# EAGLE design Yukari 4 Copernicus 11DoF (EAGLE 6.2)
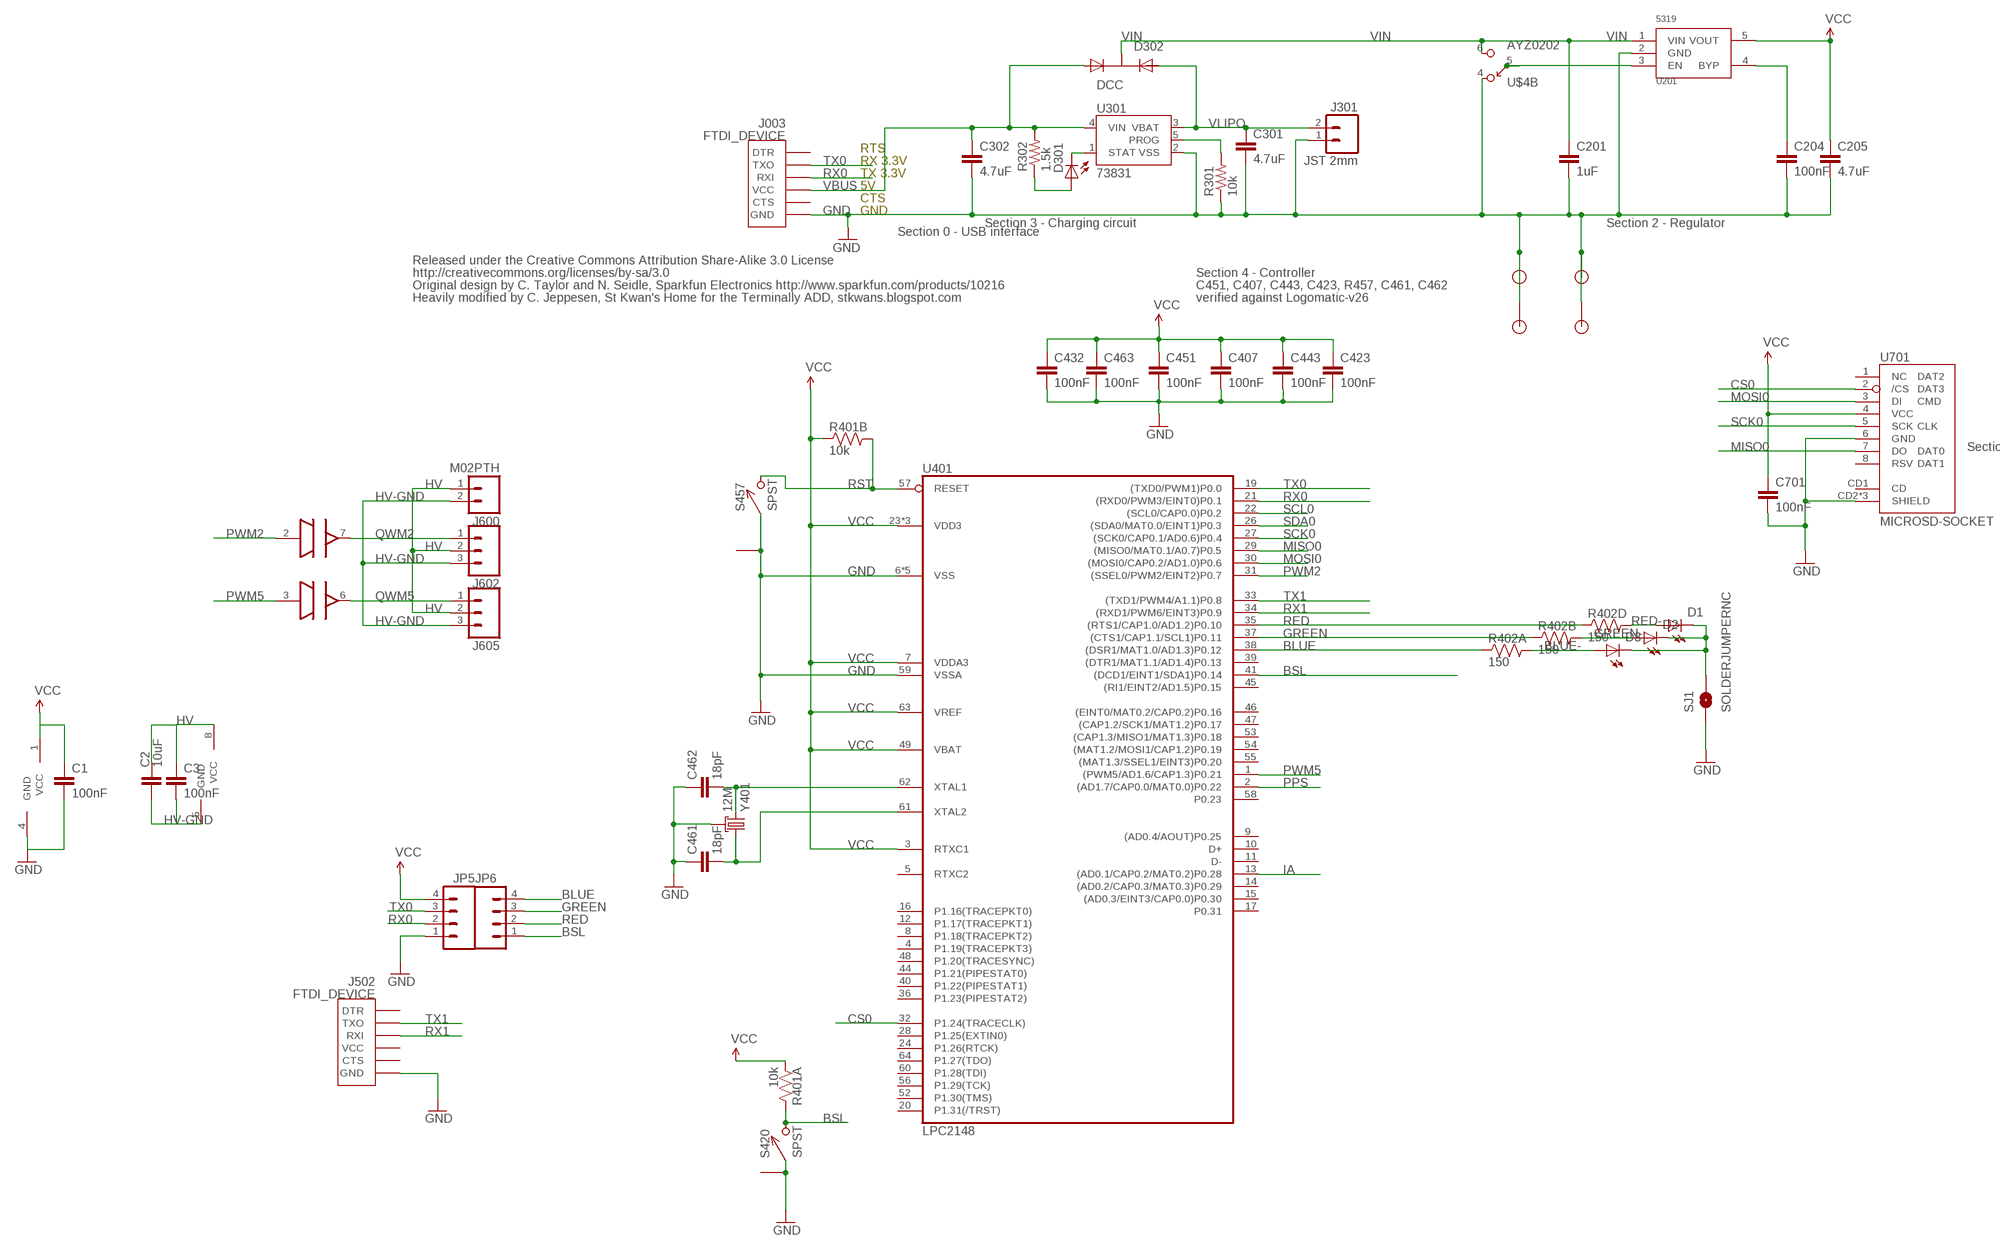
[diagram p0: schematic, sheet 1, part 1 of 2]
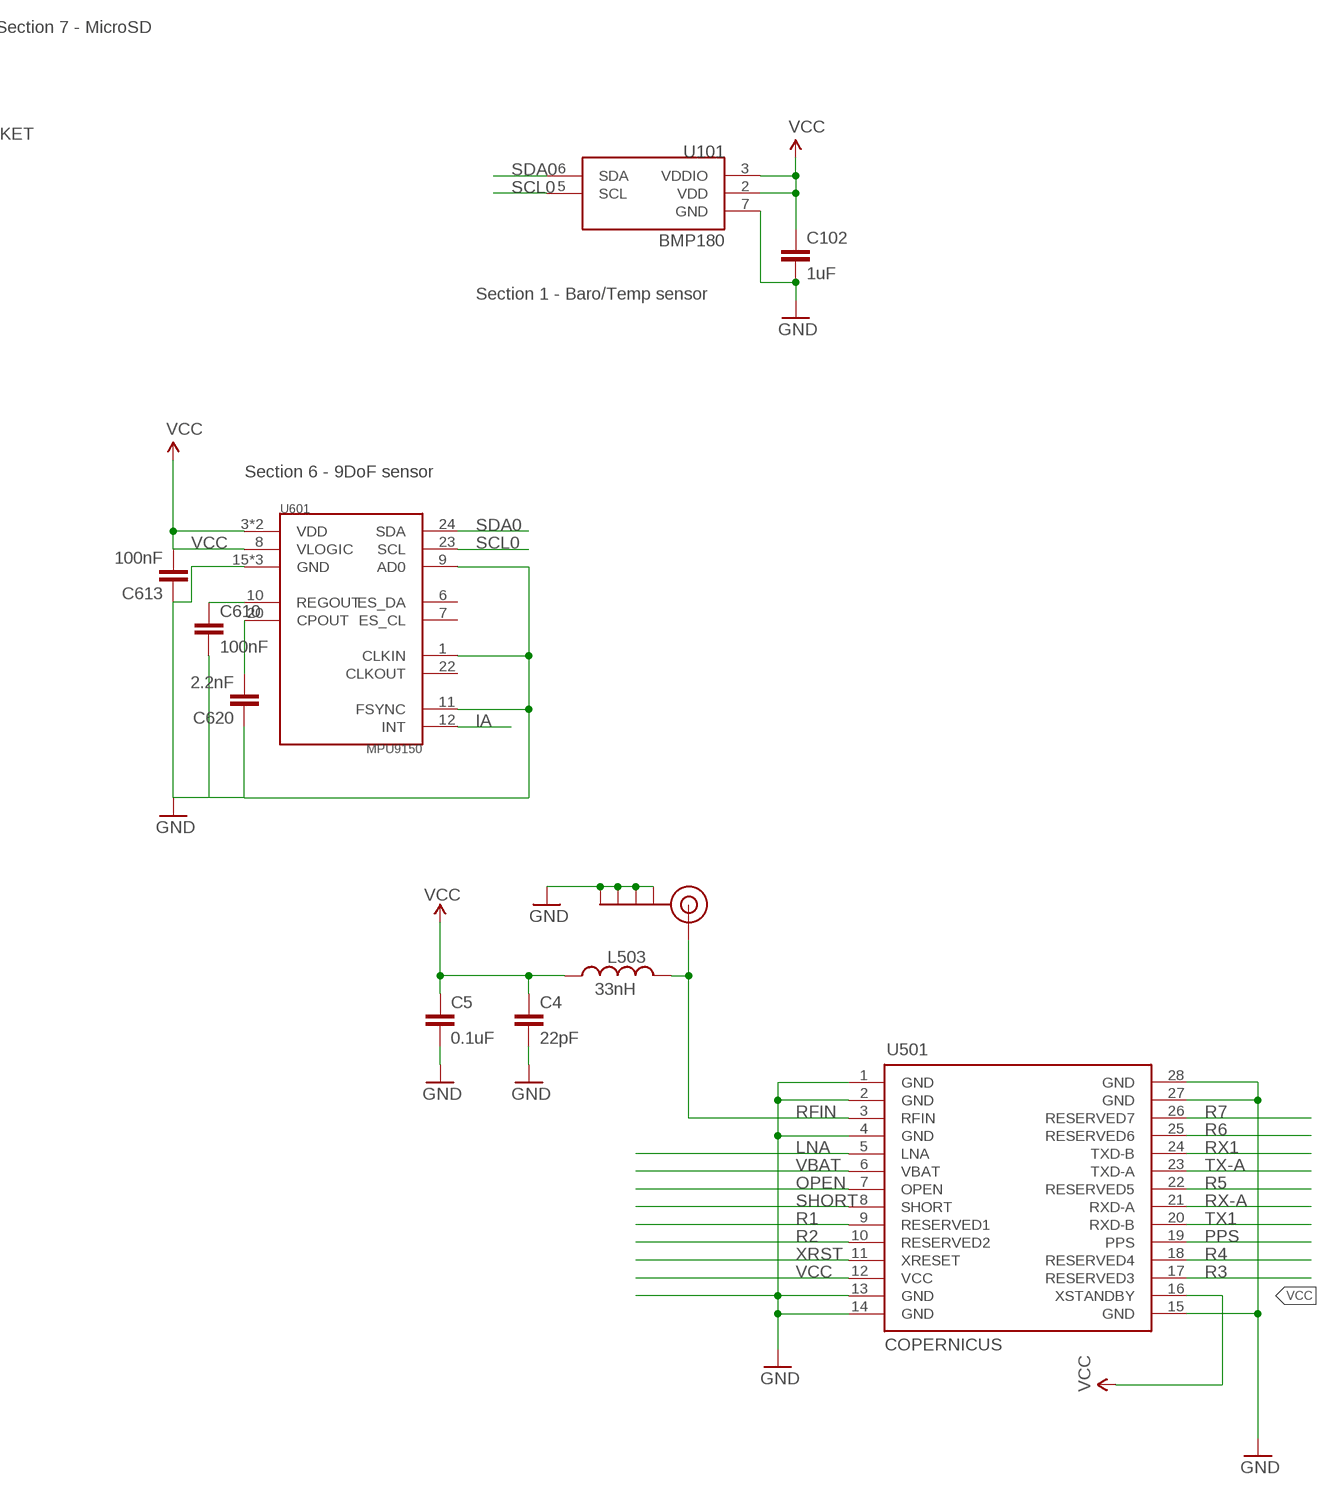
[diagram p1: schematic, sheet 1, part 2 of 2]

## Parts
C1  100nF  CAP0402-CAP  [0402-CAP]
C2  10uF  CAP0603-CAP  [0603-CAP]
C3  100nF  CAP0402-CAP  [0402-CAP]
C4  22pF  CAP0603-CAP  [0603-CAP]
C5  0.1uF  CAP0603-CAP  [0603-CAP]
C102  1uF  CAP0402-CAP  [0402-CAP]
C201  1uF  CAP0402-CAP  [0402-CAP]
C204  100nF  CAP0402-CAP  [0402-CAP]
C205  4.7uF  CAP0402-CAP  [0402-CAP]
C301  4.7uF  CAP0402-CAP  [0402-CAP]
C302  4.7uF  CAP0402-CAP  [0402-CAP]
C407  100nF  CAP0402-CAP  [0402-CAP]
C423  100nF  CAP0402-CAP  [0402-CAP]
C432  100nF  CAP0402-CAP  [0402-CAP]
C443  100nF  CAP0402-CAP  [0402-CAP]
C451  100nF  CAP0402-CAP  [0402-CAP]
C461  18pF  CAP0402-CAP  [0402-CAP]
C462  18pF  CAP0402-CAP  [0402-CAP]
C463  100nF  CAP0402-CAP  [0402-CAP]
C610  100nF  CAP0402-CAP  [0402-CAP]
C613  100nF  CAP0402-CAP  [0402-CAP]
C620  2.2nF  CAP0402-CAP  [0402-CAP]
C701  100nF  CAP0402-CAP  [0402-CAP]
D1  RED  LED0603  [LED-0603]
D2  GREEN  LED0603  [LED-0603]
D3  BLUE  LED0603  [LED-0603]
D301  RED  LED0603  [LED-0603]
D302  DCC  PMEG2005CT  [SOT-23-3]
J003  FTDI_DEVICE  [FTDI_DEVICE_SIDE]
J301  JST 2mm  M02-JST-2MM-SMT  [JST-2-SMD]
J502  FTDI_DEVICE  [FTDI_DEVICE_SIDE]
J600  M02PTH  [1X02]
J602  M03PTH  [1X03]
J605  M03PTH  [1X03]
JP1  STANDOFF  [STANDOFF]
JP2  STANDOFF  [STANDOFF]
JP3  STANDOFF  [STANDOFF]
JP4  STANDOFF  [STANDOFF]
JP5  M04PTH  [1X04]
JP6  M04PTH  [1X04]
JP7  SMA_EDGE  [SMA_EDGE]
L503  33nH  INDUCTOR0603  [0603]
R301  10k  RESISTOR0402-RES  [0402-RES]
R302  1.5k  RESISTOR0402-RES  [0402-RES]
R401  10k  RP2EXB24V  [CRA02]
R402  150  RP404  [CRA04]
S420  SPST  B3U-1100P  [B3U-1100P]
S457  SPST  B3U-1100P  [B3U-1100P]
SJ1  SOLDERJUMPERNC  [SJ_2S]
U101  BMP180  [BMP180]
U201  5319  MIC5319D5  [SOT-23-5]
U301  73831  MCP73831  [SOT23-5]
U401  LPC2148  [LQFP64]
U501  COPERNICUS  COPERNICUSSMD  [COPERNICUS]
U600  ADUM3221  [SO8N]
U601  MPU9150  [LLGA24]
U701  MICROSD-SOCKET  [MICROSD-SOCKET-PP]
U$4  AYZ0202  [AYZ0202]
Y401  12M  TSX-3225  [CRYSTAL_SMD]

## Nets
BLUE: JP6.4 R402.1 U401.38((DSR1/MAT1.0/AD1.3)P0.12)
BLUE-: D3.A R402.8
BSL: JP6.1 R401.4 S420.P$2 U401.41((DCD1/EINT1/SDA1)P0.14)
CHG_PROG: R301.2 U301.5(PROG)
CS0: U401.32(P1.24(TRACECLK)) U701.2(/CS)
EN: U201.3(EN) U$4.5
GND: C1.2 C4.2 C5.2 C102.2 C201.2 C204.2 C205.2 C301.2 C302.2 C407.2 C423.2 C432.2 C443.2 C451.2 C461.1 C462.1 C463.2 C610.2 C613.1 C620.1 C701.2 J003.P$6(GND) J301.1 J502.P$6(GND) JP1.P$1 JP2.P$1 JP3.P$1 JP4.P$1 JP5.1 JP7.GND@0(GND) JP7.GND@1(GND) JP7.GND@2(GND) JP7.GND@3(GND) R301.1 S420.P$1 S420.P$3 S457.P$1 S457.P$3 SJ1.1 U101.7(GND) U201.2(GND) U301.2(VSS) U401.6(VSS) U401.18(VSS) U401.25(VSS) U401.42(VSS) U401.50(VSS) U401.59(VSSA) U501.1(GND) U501.2(GND) U501.4(GND) U501.13(GND) U501.14(GND) U501.15(GND) U501.27(GND) U501.28(GND) U600.4(INP:GND) U601.1(CLKIN) U601.9(AD0) U601.11(FSYNC) U601.15(GND) U601.17(GND) U601.18(GND) U701.6(GND) U701.CD2(SHIELD) U701.GND1(SHIELD) U701.GND3(SHIELD) U$4.4 Y401.2(GND) Y401.4(GND)
GREEN: JP6.3 R402.2 U401.37((CTS1/CAP1.1/SCL1)P0.11)
GREEN-: D2.A R402.7
HV: C2.1 C3.1 J600.1 J602.2 J605.2 U600.8(OUTP:VCC)
HV-GND: C2.2 C3.2 J600.2 J602.3 J605.3 U600.5(OUTP:GND)
IA: U401.13((AD0.1/CAP0.2/MAT0.2)P0.28) U601.12(INT)
LNA: U501.5(LNA)
MISO0: U401.29((MISO0/MAT0.1/A0.7)P0.5) U701.7(DO)
MOSI0: U401.30((MOSI0/CAP0.2/AD1.0)P0.6) U701.3(DI)
N$1: D1.C D2.C D3.C SJ1.2
N$2: C610.1 U601.10(REGOUT)
N$3: C620.2 U601.20(CPOUT)
N$17: C204.1 U201.4(BYP)
OPEN: U501.7(OPEN)
PPS: U401.2((AD1.7/CAP0.0/MAT0.0)P0.22) U501.19(PPS)
PWM2: U401.31((SSEL0/PWM2/EINT2)P0.7) U600.2(A:IN)
PWM5: U401.1((PWM5/AD1.6/CAP1.3)P0.21) U600.3(B:IN)
QWM2: J602.1 U600.7(A:OUT)
QWM5: J605.1 U600.6(B:OUT)
R1: U501.9(RESERVED1)
R2: U501.10(RESERVED2)
R3: U501.17(RESERVED3)
R4: U501.18(RESERVED4)
R5: U501.22(RESERVED5)
R6: U501.25(RESERVED6)
R7: U501.26(RESERVED7)
RED: JP6.2 R402.4 U401.35((RTS1/CAP1.0/AD1.2)P0.10)
RED-: D1.A R402.5
RFIN: JP7.SIG(SIGNAL) L503.2 U501.3(RFIN)
RST: R401.3 S457.P$2 U401.57(RESET)
RX0: J003.P$3(RXI) JP5.2 U401.21((RXD0/PWM3/EINT0)P0.1)
RX1: J502.P$3(RXI) U401.34((RXD1/PWM6/EINT3)P0.9) U501.24(TXD-B)
RX-A: U501.21(RXD-A)
SCK0: U401.27((SCK0/CAP0.1/AD0.6)P0.4) U701.5(SCK)
SCL0: U101.5(SCL) U401.22((SCL0/CAP0.0)P0.2) U601.23(SCL)
SDA0: U101.6(SDA) U401.26((SDA0/MAT0.0/EINT1)P0.3) U601.24(SDA)
SHORT: U501.8(SHORT)
STAT+: D301.A R302.1
STAT-: D301.C U301.1(STAT)
TX0: J003.P$2(TXO) JP5.3 U401.19((TXD0/PWM1)P0.0)
TX1: J502.P$2(TXO) U401.33((TXD1/PWM4/A1.1)P0.8) U501.20(RXD-B)
TX-A: U501.23(TXD-A)
VBAT: U501.6(VBAT)
VBUS [power]: C302.1 D302.1(A1) J003.P$4(VCC) R302.2 U301.4(VIN)
VCC: C1.1 C4.1 C5.1 C102.1 C205.1 C407.1 C423.1 C432.1 C443.1 C451.1 C463.1 C613.2 C701.1 JP5.4 L503.1 R401.1 R401.2 U101.2(VDD) U101.3(VDDIO) U201.5(VOUT) U401.3(RTXC1) U401.7(VDDA3) U401.23(VDD3) U401.43(VDD3) U401.49(VBAT) U401.51(VDD3) U401.63(VREF) U501.12(VCC) U501.16(XSTANDBY) U600.1(INP:VCC) U601.3(VDD) U601.8(VLOGIC) U601.13(VDD) U701.4(VCC)
VIN: C201.1 D302.3(K) U201.1(VIN) U$4.6
VLIPO [power]: C301.1 D302.2(A2) J301.2 U301.3(VBAT)
XRST: U501.11(XRESET)
XTAL1: C462.2 U401.62(XTAL1) Y401.3
XTAL2: C461.2 U401.61(XTAL2) Y401.1
Unconnected: J003.P$1(DTR) J003.P$5(CTS) J502.P$1(DTR) J502.P$4(VCC) J502.P$5(CTS) R402.3 R402.6 U401.4(P1.19(TRACEPKT3)) U401.5(RTXC2) U401.8(P1.18(TRACEPKT2)) U401.9((AD0.4/AOUT)P0.25) U401.10(D+) U401.11(D-) U401.12(P1.17(TRACEPKT1)) U401.14((AD0.2/CAP0.3/MAT0.3)P0.29) U401.15((AD0.3/EINT3/CAP0.0)P0.30) U401.16(P1.16(TRACEPKT0)) U401.17(P0.31) U401.20(P1.31(/TRST)) U401.24(P1.26(RTCK)) U401.28(P1.25(EXTIN0)) U401.36(P1.23(PIPESTAT2)) U401.39((DTR1/MAT1.1/AD1.4)P0.13) U401.40(P1.22(PIPESTAT1)) U401.44(P1.21(PIPESTAT0)) U401.45((RI1/EINT2/AD1.5)P0.15) U401.46((EINT0/MAT0.2/CAP0.2)P0.16) U401.47((CAP1.2/SCK1/MAT1.2)P0.17) U401.48(P1.20(TRACESYNC)) U401.52(P1.30(TMS)) U401.53((CAP1.3/MISO1/MAT1.3)P0.18) U401.54((MAT1.2/MOSI1/CAP1.2)P0.19) U401.55((MAT1.3/SSEL1/EINT3)P0.20) U401.56(P1.29(TCK)) U401.58(P0.23) U401.60(P1.28(TDI)) U401.64(P1.27(TDO)) U601.6(ES_DA) U601.7(ES_CL) U601.22(CLKOUT) U701.1(NC) U701.8(RSV) U701.CD1(CD) U$4.1 U$4.2 U$4.3

## Notes on the sheet
- RTS
- RX 3.3V
- TX 3.3V
- 5V
- CTS
- GND
- Section 0 - USB interface | Section 3 - Charging circuit | Section 2 - Regulator
- Released under the Creative Commons Attribution Share-Alike 3.0 License
- http://creativecommons.org/licenses/by-sa/3.0 | Section 4 - Controller
- Original design by C. Taylor and N. Seidle, Sparkfun Electronics http://www.sparkfun.com/products/10216 | C451, C407, C443, C423, R457, C461, C462
- Heavily modified by C. Jeppesen, St Kwan's Home for the Terminally ADD, stkwans.blogspot.com | verified against Logomatic-v26
- Section 7 - MicroSD
- Section 1 - Baro/Temp sensor
- Section 6 - 9DoF sensor

## Library data of the parts
C1 C3 C201 C204 C205 C301 C302 C407 C423 C432 C443 C451 C461-C463 C701 = SparkFun:CAP: Capacitor Standard 0603 ceramic capacitor, and 0.1" leaded capacitor.
C2 = SparkFun:CAP: Capacitor Standard 0603 ceramic capacitor, and 0.1" leaded capacitor.; DIGIKEY: 445-7486-1-ND
C4 C5 = SparkFun-Passives:CAP: Capacitor Standard 0603 ceramic capacitor, and 0.1" leaded capacitor.
C102 C610 C613 = SparkFun-Passives:CAP: Capacitor Standard 0603 ceramic capacitor, and 0.1" leaded capacitor.; DIGIKEY: 445-1317-2-ND
C620 = SparkFun-Passives:CAP: Capacitor Standard 0603 ceramic capacitor, and 0.1" leaded capacitor.; DIGIKEY: 445-1309-2-ND
D1-D3 D301 = SparkFun:LED: LEDs Standard schematic elements and footprints for 5mm, 3mm, 1206, and 0603 sized LEDs. 5mm - Spark Fun Electronics SKU : COM-00529 (and others)
D302 = KwanSystems:PMEG2005CT
J003 J502 = SparkFun-Connectors:FTDI_DEVICE: Connector which mates to FTDI basic or FTDI cable.
J301 = SparkFun:M02: Header 2 Standard 2-pin 0.1" header. Use with straight break away headers (SKU : PRT-00116), right angle break away headers (PRT-00553), swiss pins (PRT-00743), machine pins (PRT-00117), and female headers (PRT-00115). Molex polarized connector foot print use with SKU : PRT-08233 with associated crimp pins and housings.
J600 = SparkFun-Connectors:M02: Standard 2-pin 0.1" header. Use with - straight break away headers ( PRT-00116) - right angle break away headers (PRT-00553) - swiss pins (PRT-00743) - machine pins (PRT-00117) - female headers (PRT-00115) Molex polarized connector foot print use with: PRT-08233 with associated crimp pins and housings. 2.54_SCREWTERM for use with PRT-10571. 3.5mm Screw Terminal footprints for PRT-08084 5mm Screw Terminal footprints for use with PRT-08433
J602 J605 = SparkFun-Connectors:M03: Header 3 Standard 3-pin 0.1" header. Use with straight break away headers (SKU : PRT-00116), right angle break away headers (PRT-00553), swiss pins (PRT-00743), machine pins (PRT-00117), and female headers (PRT-00115). Molex polarized connector foot print use with SKU : PRT-08232 with associated crimp pins and housings.
JP1-JP4 = KwanSystems:STANDOFF
JP5 JP6 = SparkFun-Connectors:M04: Header 4 Standard 4-pin 0.1" header. Use with straight break away headers (SKU : PRT-00116), right angle break away headers (PRT-00553), swiss pins (PRT-00743), machine pins (PRT-00117), and female headers (PRT-00115). Molex polarized connector foot print use with SKU : PRT-08231 with associated crimp pins and housings. 1MM SMD Version SKU: PRT-10208
JP7 = SparkFun-Nate:SMA_EDGE
L503 = SparkFun-Passives:INDUCTOR: Inductors Basic Inductor/Choke - 0603 and 1206. Footprints are not proven and vary greatly between part numbers.
R301 R302 = SparkFun:RESISTOR: Resistor Basic schematic elements and footprints for 0603, 1206, and PTH resistors.
R401 = KwanSystems:RP2
R402 = KwanSystems:RP4
S420 S457 = KwanSystems:B3U-1100P
SJ1 = SparkFun-Passives:SOLDERJUMPER: Solder Jumper Standard SMD solder jumper. Used to automate production. Two varients : Normally Open and Normally Closed are the same, but have different paste layers. NC will have a large amount of paste and should jumper during reflow.
U101 = KwanSystems:BMP180; DIGIKEY: 828-1027-1-ND
U201 = KwanSystems:MIC5319
U301 = SparkFun:MCP73831: Microchip's MCP73831 Miniature single cell, fully integrated Li-Ion, Li-polymer charge management controller http://ww1.microchip.com/downloads/en/DeviceDoc/21984a.pdf
U401 = KwanSystems:LPC2148
U501 = SparkFun-RF:COPERNICUS: Copernicus II GPS- Trimble recommended layout and paste layer. Footprint production proven. Spark Fun Electronics SKU : GPS-07951
U600 = KwanSystems:ADUM3221
U601 = KwanSystems:MPU9150
U701 = KwanSystems:MICROSD-SOCKET: microSD Socket Push-push type uSD socket. Digikey 101-00660-68-6-1-ND. tDoc lines correctly indicate media card edge positions when inserting (unlocked, locked, depressed).
U$4 = KwanSystems:AYZ0202
Y401 = KwanSystems:TSX-3225

## Net classes
0 default: width 0.152 mm, drill 0.33 mm, clearance 0.152 mm
1 power: width 0.152 mm, drill 0.33 mm, clearance 0.152 mm
2 hp: width 0.508 mm, drill 0.33 mm, clearance 0.508 mm

## Board
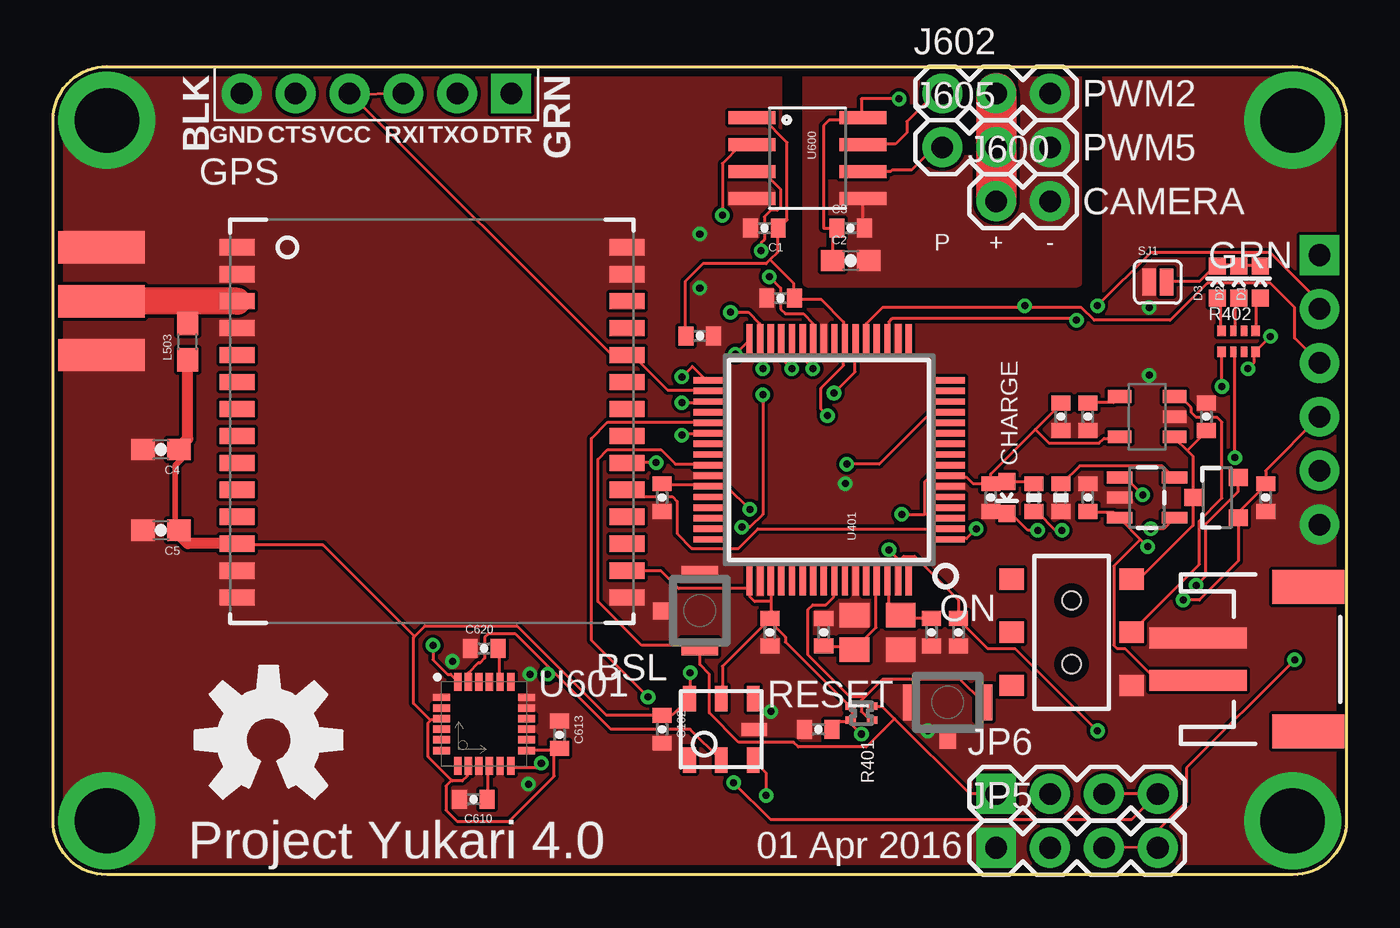
[diagram p2: board, top side]
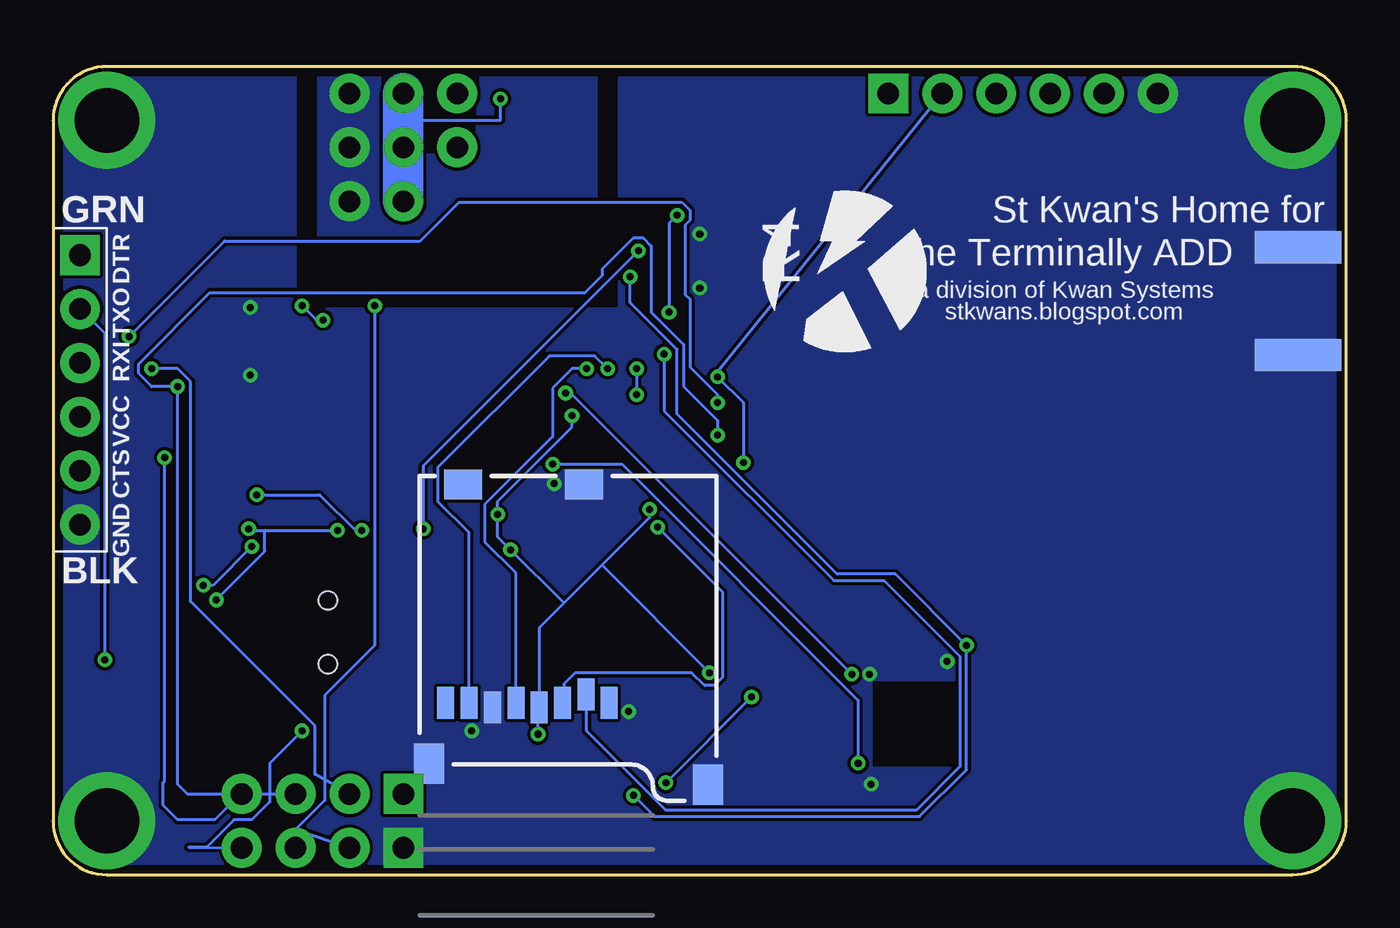
[diagram p3: board, bottom side, seen from below]

Size 60.96 x 38.1 mm. Coordinates in mm from the lower left corner, seen from the top.
Outline: 2.54,38.1 58.42,38.1 arc-90 60.96,35.56 60.96,2.54 arc-90 58.42,0 2.54,0 arc-90 0,2.54 0,35.56 arc-90 2.54,38.1
Copper layers (1*16): Top 0.0356mm / dielectric 1.5011mm / Bottom 0.0356mm
Design rules: minimum track width 6mil, minimum drill 13mil, track to track 6mil, track to pad 6mil, pad to pad 6mil, via to via 6mil, smd to smd 6mil, copper to edge 15mil, drill to drill 6mil, minimum pad ring 7mil, minimum via ring 7mil, stop-mask expansion 4mil, vias tented up to drill 14mil, thermal gap 10mil
vRestrict: area 0.3,28.7 to 19.6,31.5; area 1.5,27.2 to 19.6,27.9; area 41.9,11.9 to 43.9,13.2; area 20.1,25.1 to 27.2,32.3

### Footprints (pad centres in the part's own frame; a part is rotated, then mirrored left to right if it is on the bottom)
0402-CAP = smd 0.7 x 0.9: 1 -0.65,0; 2 0.65,0
0603-CAP = smd 1.1 x 1: 1 -0.85,0; 2 0.85,0
LED-0603 = smd 0.8 x 0.8: A 0,-0.75; C 0,0.75
SOT-23-3 = smd 0.9 x 0.8: 1 -1,0.95; 2 -1,-0.95; 3 1.1,0
FTDI_DEVICE_SIDE = drill 1.016 pad 1.88 square: P$1 -6.35,0 | drill 1.016 pad 1.88: P$2 -3.81,0; P$3 -1.27,0; P$4 1.27,0; P$5 3.81,0; P$6 6.35,0
JST-2-SMD = smd 1 x 4.6: 1 -1,-3.7; 2 1,-3.7 | smd 1.6 x 3.4: NC1 -3.4,1.5; NC2 3.4,1.5
1X02 = drill 1.016 pad 1.88: 1 0,0; 2 2.54,0
1X03 = drill 1.016 pad 1.88: 1 0,0; 2 2.54,0; 3 5.08,0
STANDOFF = drill 3.048 pad 4.572: P$1 0,0
1X04 = drill 1.016 pad 1.88 square: 1 0,0 | drill 1.016 pad 1.88: 2 2.54,0; 3 5.08,0; 4 7.62,0
SMA_EDGE = smd 1.524 x 4.064: GND@0 0,0; GND@1 5.08,0; SIG 2.54,0 | smd 1.524 x 4.064 bottom: GND@2 0,0; GND@3 5.08,0
0603 = smd 1.1 x 1: 1 -0.85,0; 2 0.85,0
0402-RES = smd 0.7 x 0.9: 1 -0.65,0; 2 0.65,0
CRA02 = smd 0.35 x 0.5: 1 -0.325,-0.5; 2 0.325,-0.5; 3 0.325,0.5; 4 -0.325,0.5
CRA04 = smd 0.4 x 0.5: 1 -0.8,-0.5; 4 0.8,-0.5; 5 0.8,0.5; 8 -0.8,0.5 | smd 0.3 x 0.5: 2 -0.25,-0.5; 3 0.25,-0.5; 6 0.25,0.5; 7 -0.25,0.5
B3U-1100P = smd 0.8 x 1.7: P$1 -1.7,0; P$2 1.7,0 | smd 0.8 x 1.1: P$3 0,-1.65
SJ_2S = smd 0.635 x 1.27: 1 -0.412,0; 2 0.412,0
BMP180 = smd 0.6 x 1.2: 1 1.5,1.45; 2 0,1.45; 3 -1.5,1.45; 4 -1.5,-1.45; 5 0,-1.45; 6 1.5,-1.45 | smd 1.2 x 0.6: 7 1.55,0
SOT-23-5 = smd 0.6 x 1.1: 1 -0.95,-1.3; 2 0,-1.3; 3 0.95,-1.3; 4 0.95,1.3; 5 -0.95,1.3
SOT23-5 = smd 0.55 x 1.2: 1 -0.95,-1.3; 2 0,-1.3; 3 0.95,-1.3; 4 0.95,1.3; 5 -0.95,1.3
LQFP64 = smd 0.3 x 1.6: 1 -3.75,-5.6; 2 -3.25,-5.6; 3 -2.75,-5.6; 4 -2.25,-5.6; 5 -1.75,-5.6; 6 -1.25,-5.6; 7 -0.75,-5.6; 8 -0.25,-5.6; 9 0.25,-5.6; 10 0.75,-5.6; 11 1.25,-5.6; 12 1.75,-5.6; 13 2.25,-5.6; 14 2.75,-5.6; 15 3.25,-5.6; 16 3.75,-5.6; 33 3.75,5.6; 34 3.25,5.6; 35 2.75,5.6; 36 2.25,5.6; 37 1.75,5.6; 38 1.25,5.6; 39 0.75,5.6; 40 0.25,5.6; 41 -0.25,5.6; 42 -0.75,5.6; 43 -1.25,5.6; 44 -1.75,5.6; 45 -2.25,5.6; 46 -2.75,5.6; 47 -3.25,5.6; 48 -3.75,5.6 | smd 1.6 x 0.3: 17 5.6,-3.75; 18 5.6,-3.25; 19 5.6,-2.75; 20 5.6,-2.25; 21 5.6,-1.75; 22 5.6,-1.25; 23 5.6,-0.75; 24 5.6,-0.25; 25 5.6,0.25; 26 5.6,0.75; 27 5.6,1.25; 28 5.6,1.75; 29 5.6,2.25; 30 5.6,2.75; 31 5.6,3.25; 32 5.6,3.75; 49 -5.6,3.75; 50 -5.6,3.25; 51 -5.6,2.75; 52 -5.6,2.25; 53 -5.6,1.75; 54 -5.6,1.25; 55 -5.6,0.75; 56 -5.6,0.25; 57 -5.6,-0.25; 58 -5.6,-0.75; 59 -5.6,-1.25; 60 -5.6,-1.75; 61 -5.6,-2.25; 62 -5.6,-2.75; 63 -5.6,-3.25; 64 -5.6,-3.75
COPERNICUS = smd 0.762 x 1.651: 1 0,-18.364; 2 1.27,-18.364; 3 2.54,-18.364; 4 3.81,-18.364; 5 5.08,-18.364; 6 6.35,-18.364; 7 7.62,-18.364; 8 8.89,-18.364; 9 10.16,-18.364; 10 11.43,-18.364; 11 12.7,-18.364; 12 13.97,-18.364; 13 15.24,-18.364; 14 16.51,-18.364; 15 16.51,0; 16 15.24,0; 17 13.97,0; 18 12.7,0; 19 11.43,0; 20 10.16,0; 21 8.89,0; 22 7.62,0; 23 6.35,0; 24 5.08,0; 25 3.81,0; 26 2.54,0; 27 1.27,0; 28 0,0
SO8N = smd 0.61 x 2.21: 1 -1.905,-2.616; 2 -0.635,-2.616; 3 0.635,-2.616; 4 1.905,-2.616; 5 1.905,2.616; 6 0.635,2.616; 7 -0.635,2.616; 8 -1.905,2.616
LLGA24 = smd 0.8 x 0.35: 1 -2,1.25; 2 -2,0.75; 3 -2,0.25; 4 -2,-0.25; 5 -2,-0.75; 6 -2,-1.25; 13 2,-1.25; 14 2,-0.75; 15 2,-0.25; 16 2,0.25; 17 2,0.75; 18 2,1.25 | smd 0.35 x 0.85: 7 -1.25,-1.975; 8 -0.75,-1.975; 9 -0.25,-1.975; 10 0.25,-1.975; 11 0.75,-1.975; 12 1.25,-1.975; 19 1.25,1.975; 20 0.75,1.975; 21 0.25,1.975; 22 -0.25,1.975; 23 -0.75,1.975; 24 -1.25,1.975
MICROSD-SOCKET-PP = smd 0.8 x 1.5: 1 -8.94,10.7; 2 -7.84,10.3; 3 -6.74,10.7; 4 -5.64,10.9; 5 -4.54,10.7; 6 -3.44,10.9; 7 -2.34,10.7; 8 -1.24,10.7 | smd 1.8 x 1.4: CD1 -2.05,0.4; CD2 -7.75,0.4 | smd 1.4 x 1.9: GND1 -13.6,14.55; GND3 -0.45,13.55
AYZ0202 = smd 1 x 1.15: 1 -2.5,2.825; 2 0,2.825; 3 2.5,2.825; 4 -2.5,-2.825; 5 0,-2.825; 6 2.5,-2.825 | hole 0.85: 1.5,0; -1.5,0
CRYSTAL_SMD = smd 1.4 x 1.15: 1 -1.092,-0.813; 2 1.092,-0.813; 3 1.092,0.813; 4 -1.092,0.813

### Placement (x,y rotation side)
C1  33.53,30.48 180 top
C2  37.59,28.96 0 top
C3  37.59,30.48 0 top
C4  5.08,20.05 180 top
C5  5.08,16.24 180 top
C102  28.7,6.86 270 top
C201  54.36,21.59 90 top
C204  48.77,21.59 270 top
C205  47.5,21.59 270 top
C301  48.77,17.78 90 top
C302  57.15,17.78 270 top
C407  44.2,17.78 270 top
C423  34.29,27.18 180 top
C432  30.48,25.4 0 top
C443  28.7,17.78 270 top
C451  33.78,11.43 270 top
C461  36.32,11.43 270 top
C462  41.4,11.43 90 top
C463  42.67,11.43 270 top
C610  19.81,3.56 180 top
C613  23.88,6.6 270 top
C620  20.32,10.67 0 top
C701  36.07,6.86 180 top
D1  56.9,27.94 0 top
D2  55.88,27.94 0 top
D3  54.86,27.94 0 top
D301  44.96,17.78 180 top
D302  54.86,17.78 180 top
J003  59.69,22.86 270 bottom
J301  57.66,10.16 270 top
J502  15.24,36.83 180 top
J600  44.45,31.75 0 top
J602  41.91,36.83 0 top
J605  41.91,34.29 0 top
JP1  2.54,2.54 0 top
JP2  58.42,2.54 0 top
JP3  2.54,35.56 0 top
JP4  58.42,35.56 0 top
JP5  44.45,1.27 0 top
JP6  44.45,3.81 0 top
JP7  2.29,24.5 90 top
L503  6.35,25.13 90 top
R301  47.5,17.78 90 top
R302  46.23,17.78 270 top
R401  38.1,7.62 270 top
R402  55.88,25.15 0 top
S420  30.48,12.45 270 top
S457  42.16,8.13 0 top
SJ1  52.07,27.94 0 top
U101  31.5,6.86 0 top
U201  51.56,21.59 90 top
U301  51.56,17.78 270 top
U401  36.58,19.56 90 top
U501  27.05,29.57 270 top
U600  35.56,33.78 270 top
U601  20.32,7.11 0 top
U701  43.69,18.8 180 bottom
U$1  [KWAN_CIRCLE]  23.62,28.45 0 bottom
U$2  [OSHW-LOGO-L]  10.16,6.35 0 top
U$4  48.01,11.43 90 top
Y401  38.86,11.43 0 top

### Tracks (layer width: path | path; a pad name or v marks a point on that pad's centre or on a via)
BLUE  (via drill 0.33)
  Top 0.152: v55.09,23.01 55.09,24.61 R402.1 | v29.64,20.73 29.72,20.8 30.94,20.8 U401.38
  Bottom 0.152: JP6.4 54.63,3.81 55.09,4.27 v55.09,23.01 56.31,23.01 56.92,23.62 56.92,24.08 53.57,27.43 35.89,27.43 35.05,28.27 35.05,28.57 33.6,30.02 33.15,30.02 32.77,29.64 32.77,26.52 31.24,24.99 31.24,23.01 29.64,21.41 v29.64,20.73
BLUE-
  Top 0.152: R402.8 55.02,25.68 55.02,26.98 54.86,27.13 D3.A
BSL
  Top 0.152: U401.41 30.94,19.36 29.34,19.36 28.65,20.04 26.14,20.04 25.68,19.58 25.68,12.88 27.74,10.82 30.48,10.82 S420.P$2 30.48,9.91 30.94,9.45 30.94,7.62 32.31,6.25 34.9,6.25 35.13,6.02 38.33,6.02 39.66,7.35 | 39.66,7.35 43.2,3.81 JP6.1 | 39.66,7.35 39.09,7.92 38.63,7.92 R401.4
CHG_PROG
  Top 0.152: R301.2 47.55,18.44 48.39,19.28 52.27,19.28 52.81,18.75 U301.5
CS0  (via drill 0.33)
  Top 0.152: v32.16,24.54 32.77,25.15 U401.32
  Bottom 0.152: v32.16,24.54 32.16,21.87 24.16,13.87 21.79,13.87 18.21,10.29 18.21,5.11 20.27,3.05 32.08,3.05 35.81,6.78 35.81,8.46 U701.2
EN
  Top 0.152: U201.3 52.88,22.48 53.19,22.48 53.65,22.02 53.65,21.79 53.87,21.57 54.86,21.57 55.09,21.34 55.09,17.75 54.03,16.69 54.03,14.63 U$4.5
GND  (via drill 0.33)
  other vias: 30.48,30.2 30.48,27.66 22.4,4.27 18.82,10.06 33.83,7.7 22.48,9.45 41.22,6.78 51.66,26.75 51.66,23.55 37.34,18.44
  pour Top (no thermals): 2.54,38.1 34.29,38.1 34.29,26.67 49.53,26.67 49.53,38.1 58.42,38.1 arc-90 60.96,35.56 60.96,2.54 arc-90 58.42,0 2.54,0 arc-90 0,2.54 0,35.56 arc-90
  pour Bottom (no thermals): 2.54,38.1 34.29,38.1 34.29,26.67 49.53,26.67 49.53,38.1 58.42,38.1 arc-90 60.96,35.56 60.96,2.54 arc-90 58.42,0 2.54,0 arc-90 0,2.54 0,35.56 arc-90
GREEN  (via drill 0.33)
  Top 0.152: v55.7,19.66 55.7,24.61 R402.2 | v28.04,8.38 25.38,11.05 25.38,20.57 26.14,21.34 30.94,21.34 U401.37 | v32.08,4.34 33.83,2.59 50.83,2.59 52.05,3.81 JP6.3
  Bottom 0.152: v55.7,19.66 55.7,4.42 55.78,4.34 55.78,3.28 55.09,2.59 53.34,2.59 52.12,3.81 JP6.3 | v32.08,4.34 v28.04,8.38
GREEN-
  Top 0.152: R402.7 55.7,25.68 55.7,26.98 55.85,27.13 D2.A
HV  (via drill 0.33)
  Top 0.152: C2.1 36.74,30.28 C3.1 36.32,30.48 36.32,35.31 36.58,35.56 38.05,35.56 U600.8 38.1,35.69 38.1,36.58 v39.88,36.58
  Top 1.905: J602.2 J605.2 J600.1
  Bottom 0.152: J602.2 44.45,35.56 39.88,35.56 v39.88,36.58 39.88,36.83
  Bottom 1.905: J600.1 J605.2 J602.2
HV-GND
  Top 0.152: C3.2 38.18,30.55 U600.5
  pour Bottom (no thermals): 35.56,38.1 35.56,27.94 48.26,27.94 48.26,38.1
  pour Top (no thermals): 35.56,38.1 35.56,27.94 48.26,27.94 48.26,38.1
IA  (via drill 0.33)
  Top 0.152: v23.01,5.26 22.78,5.03 21.72,5.03 21.64,5.11 U601.12 | v37.41,19.36 38.94,19.36 41.38,21.79 42.14,21.79 U401.13
  Bottom 0.152: v23.01,5.26 23.01,8.23 34.14,19.36 v37.41,19.36
MISO0  (via drill 0.33)
  Top 0.152: v34.82,23.85 34.37,24.31 34.37,25.15 U401.29
  Bottom 0.152: v34.82,23.85 35.43,24.46 37.57,24.46 42.82,19.2 42.82,17.6 41.38,16.15 41.38,8.15 U701.7
MOSI0  (via drill 0.33)
  Top 0.152: v32.46,16.38 32.84,16.38 33.45,16.99 v33.45,22.63 | v33.45,23.85 33.45,24 33.76,24.31 33.76,25.15 U401.30
  Bottom 0.152: v32.46,16.38 29.41,13.34 29.41,9.3 29.79,8.91 30.25,8.91 30.86,9.53 36.35,9.53 36.88,8.99 36.88,8.15 U701.3 | v33.45,23.85 v33.45,22.63
N$1
  Top 0.152: D1.C 56.84,28.73 55.93,28.73 D2.C 55.85,28.73 54.86,28.73 D3.C 54.86,28.65 54.71,28.65 54.03,27.96 52.5,27.96 SJ1.2
N$2
  Top 0.152: U601.10 20.5,5.11 20.5,3.58 C610.1
N$3
  Top 0.152: U601.20 21.03,9.14 21.03,10.67 C620.2
N$17
  Top 0.152: C204.1 49.99,22.25 50.22,22.48 U201.4
PPS
  Top 0.152: U401.2 42.14,16.31 33.22,16.31 32.31,15.39 30.1,15.39 29.41,16.08 29.41,17.6 29.18,17.83 27.36,17.83 U501.19
PWM2  (via drill 0.33)
  Top 0.152: v31.93,26.52 32.77,26.52 33.3,25.98 33.3,25.22 U401.31 | v31.55,31.09 31.55,33.53 32.38,34.37 32.92,34.37 U600.2
  Bottom 0.152: v31.93,26.52 31.93,30.71 v31.55,31.09
PWM5  (via drill 0.33)
  Top 0.152: v43.51,16.31 43.05,15.85 42.22,15.85 U401.1 | v33.38,29.41 33.38,29.79 33.53,29.95 33.53,31.01 33.83,31.32 34.14,31.32 34.29,31.47 34.29,32.31 33.45,33.15 U600.3
  Bottom 0.152: v43.51,16.31 43.51,19.28 v33.38,29.41
QWM2
  Top 0.152: U600.7 38.18,34.44 39.7,34.44 40.23,34.98 40.23,35.51 41.53,36.8 41.91,36.8 J602.1
QWM5
  Top 0.152: U600.6 39.47,33.15 39.55,33.22 40.46,33.22 41.53,34.29 J605.1
RED  (via drill 0.33)
  Top 0.152: v56.31,23.85 56.62,24.16 56.62,24.61 R402.4 56.69,24.69 v57.38,25.38 | v29.64,22.25 30.94,22.25 U401.35
  Bottom 0.152: v56.31,23.85 55.09,23.85 54.48,23.24 54.48,12.88 48.62,7.01 48.62,4.72 JP6.2 | v29.64,22.25 29.64,22.63 30.94,23.93 30.94,27.13 31.17,27.36 31.17,30.63 30.94,30.86 30.94,31.32 31.32,31.7 41.83,31.7 43.66,29.87 52.88,29.87 v57.38,25.38
RED-
  Top 0.152: R402.5 56.69,25.68 56.69,26.98 56.84,27.13 D1.A
RFIN
  Top 0.508: 6.35,27.16 6.35,27.04 L503.2
  Top 1.27: U501.3 6.35,27.04 JP7.SIG
RST
  Top 0.152: 38.21,8.34 39.09,9.22 42.75,9.22 43.81,8.15 S457.P$2 | 38.21,8.34 38.1,8.23 38.1,7.7 38.33,7.47 38.41,7.47 38.56,7.32 R401.3 | U401.57 36.8,13.95 36.8,13.11 36.42,12.72 35.81,12.72 35.59,12.5 35.59,10.36 37.57,8.38 38.18,8.38 38.21,8.34
RX0  (via drill 0.33)
  Top 0.152: 45.8,26.75 48.46,26.75 49.07,26.14 52.65,26.14 54.41,27.89 57.38,27.89 58.52,26.75 58.52,25.3 J003.P$3 | 45.8,26.75 39.09,26.75 38.33,25.98 38.33,25.22 U401.21 | 45.8,26.75 v45.8,26.82
  Bottom 0.152: JP5.2 49.53,2.13 48.16,3.5 48.16,8.46 45.8,10.82 v45.8,26.82
RX1
  Top 0.152: U401.34 30.94,22.86 28.96,22.86 27.36,24.46 27.05,24.46 U501.24 27.05,24.54 26.29,24.54 14.02,36.8 J502.P$3
SCK0  (via drill 0.33)
  Top 0.152: v35.81,23.85 35.36,24.31 35.36,25.15 U401.27
  Bottom 0.152: v35.81,23.85 36.5,23.85 37.41,22.94 37.41,20.65 40.62,17.45 40.62,15.7 39.17,14.25 39.17,8.15 U701.5
SCL0  (via drill 0.33)
  Top 0.152: 23.51,9.64 26.29,6.86 30.02,6.86 31.47,5.41 U101.5 | 23.51,9.64 21.79,11.35 20.5,11.35 20.34,11.2 20.34,10.21 20.12,9.98 20.04,9.98 19.58,9.53 19.58,9.14 U601.23 | v36.8,22.71 37.8,23.7 37.8,25.15 U401.22 | 23.51,9.64 v23.32,9.45
  Bottom 0.152: v36.8,22.71 36.58,22.71 v23.32,9.45
SDA0  (via drill 0.33)
  Top 0.152: v17.91,10.82 17.91,10.13 18.59,9.45 18.75,9.45 19.05,9.14 U601.24 | v33.6,3.73 33.6,4.8 33.07,5.33 U101.6 | v33.76,28.19 34.29,27.66 34.29,26.67 34.52,26.44 35.36,26.44 35.81,25.98 35.81,25.22 U401.26
  Bottom 0.152: v33.6,3.73 32.61,2.74 20.12,2.74 17.91,4.95 v17.91,10.82 21.26,14.17 24,14.17 31.55,21.72 31.55,24.77 33.76,26.98 v33.76,28.19
STAT+
  Top 0.152: D301.A 44.96,18.52 46.1,18.52 46.18,18.44 R302.1
STAT-  (via drill 0.33)
  Top 0.152: v46.41,16.23 45.95,16.23 45.19,16.99 44.96,16.99 D301.C | v51.36,17.91 50.6,18.67 50.29,18.67 U301.1
  Bottom 0.152: v46.41,16.23 46.71,16.23 48.39,17.91 v51.36,17.91
TX0  (via drill 0.33)
  Top 0.152: v48.23,26.14 48.16,26.21 39.55,26.21 39.4,26.06 39.4,25.22 U401.19 | v49.23,26.82 51.74,29.34 57.38,29.34 59.66,27.05 59.66,26.67 J003.P$2 | v58.52,10.13 53.42,5.03 53.42,3.43 52.12,2.13 52.12,1.29 JP5.3
  Bottom 0.152: v48.23,26.14 48.54,26.14 v49.23,26.82 | v58.52,10.13 58.52,25.53 59.66,26.67 J003.P$2
TX1  (via drill 0.33)
  Top 0.152: U401.33 30.94,23.32 30.79,23.32 30.14,23.96 v29.64,23.47 | v28.42,19.43 27.05,19.43 U501.20
  Bottom 0.152: v28.42,19.43 28.42,22.25 v29.64,23.47 29.64,23.7 J502.P$2
VBUS  (via drill 0.33)
  Top 0.152: v47.55,16.23 47.24,16.23 46.41,17.07 46.25,17.07 R302.2 | v51.74,16.31 52.35,16.31 52.81,16.76 U301.4 | J003.P$4 57.15,19.05 C302.1 57.15,18.36 55.93,17.14 55.93,16.84 D302.1 55.85,16.76 55.85,14.78 54.03,12.95 v53.26,12.95
  Bottom 0.152: 50.98,16.23 51.66,16.23 v51.74,16.31 | 50.98,16.23 v47.55,16.23 | 50.98,16.23 50.98,15.24 v53.26,12.95
VCC  (via drill 0.33)
  Top 0.152: 23.62,5.87 23.77,5.87 23.85,5.94 C613.2 23.62,5.87 | 23.62,5.87 U601.13 | 17.79,7.28 17.68,7.16 17.68,5.56 18.78,4.46 | 17.79,7.28 17.83,7.32 18.29,7.32 U601.3 | 18.78,4.46 18.82,4.42 19.28,4.42 19.51,4.65 19.51,5.11 U601.8 | 23.62,5.87 23.62,4.65 21.49,2.52 19.05,2.52 18.52,3.05 18.52,4.19 18.78,4.46 | 17.03,11.24 16.99,11.2 16.99,8.08 17.79,7.28 | 17.03,11.24 17.53,11.73 21.87,11.73 26.06,7.54 28.65,7.54 C102.1 28.73,7.54 29.18,7.54 29.95,8.31 U101.3 30.02,8.38 v30.02,9.53 | 17.03,11.24 12.72,15.54 8.91,15.54 U501.12 | 33.8,28.99 34.14,29.34 34.14,30.48 C1.1 34.21,30.48 34.59,30.86 34.59,34.52 33.45,35.66 32.99,35.66 U600.1 | 33.8,28.99 33.6,28.8 30.63,28.8 29.79,27.96 29.79,25.45 C432.1 | 33.8,28.99 34.9,27.89 34.9,27.2 C423.1 34.98,27.13 36.2,27.13 37.26,26.06 37.26,25.22 U401.23 37.26,25.15 37.26,24 36.2,22.94 36.2,21.95 v36.5,21.64 | C407.1 43.36,18.44 43.05,18.75 42.22,18.75 U401.7 42.14,18.75 41.3,18.75 41.07,18.52 41.07,17.07 41.11,17.03 | 46.29,20.99 44.2,18.9 C407.1 | 46.29,20.99 47.47,22.17 C205.1 | C407.1 | 46.29,20.99 46.94,20.34 49.3,20.34 49.53,20.57 50.22,20.57 U201.5 | 41.11,17.03 41.3,16.84 42.14,16.84 U401.3 | 39.89,14.82 39.85,14.78 39.85,14.02 U401.63 | 39.89,14.82 40.08,15.01 40.62,15.01 42.67,12.95 C463.1 42.67,12.04 44.04,10.67 45.34,10.67 v49.23,6.78 | C443.1 28.73,18.36 30.94,18.36 U401.43 31.01,18.29 31.77,18.29 v32.84,17.22 | R401.2 37.64,7.32 37.64,7.92 R401.1 37.57,8 37.49,8 34.52,10.97 34.52,11.2 33.76,11.96 C451.1 | R401.2 37.57,7.24 37.11,7.24 C701.1 | 33.83,12.88 33.83,13.95 U401.51 | 33.83,12.88 33.83,12.12 C451.1
  Top 0.152: U101.2 31.55,8.38 31.55,9.83 33.76,12.04 C451.1 | v38.1,6.63 37.57,7.16 R401.2 | 32.84,13.49 32.84,13.11 33.07,12.88 33.83,12.88 | 32.84,13.49 32.84,13.95 U401.49 32.84,13.49 | 32.84,13.49 29.49,13.49 28.65,14.33 U501.16 | v39.4,15.32 39.89,14.82 | v40.01,16.99 41.07,16.99 41.11,17.03
  Top 0.254: C4.1 6.08,20.05 6.35,20.32 6.35,19.89 5.75,19.29 5.75,16.42 C5.1
  Top 0.508: C4.1 5.84,20.05 6.35,20.56 L503.1 | 5.73,16.38 5.71,16.37 5.73,16.35 C5.1 5.71,16.24 6.35,15.61 U501.12
  Bottom 0.152: v38.1,6.63 38.1,7.85 U701.4 38.02,7.92 38.02,11.66 36.88,12.8 | v32.84,17.22 32.84,16.84 35.09,14.59 | 36.88,12.8 35.09,14.59 | 36.88,12.8 v39.4,15.32 40.01,15.93 v40.01,16.99 40.01,17.6 36.5,21.11 v36.5,21.64 | v49.23,6.78 50.75,5.26 50.75,3.43 51.59,2.59 52.43,2.59 53.72,1.29 54.56,1.29 JP5.4 | 35.09,14.59 v30.02,9.53
VIN
  Top 0.152: 53.45,20 52.88,20.57 U201.1 | 53.45,20 53.72,19.74 53.72,17.83 D302.3 53.72,17.75 53.72,16.46 51.21,13.95 50.9,13.95 U$4.6 | 53.45,20 54.33,20.88 C201.1
VLIPO  (via drill 0.33)
  Top 0.152: C301.1 48.77,17.07 49.99,17.07 50.22,16.84 U301.3 50.29,16.76 51.24,15.81 | v53.87,13.64 54.33,14.1 54.33,16.54 55.85,18.06 55.85,18.67 D302.2 | 51.24,15.81 v51.59,15.47 | 51.24,15.81 49.99,14.55 49.99,10.82 50.14,10.67 50.52,10.67 51.97,9.22 53.95,9.22 J301.2
  Bottom 0.152: v53.87,13.64 53.42,13.64 v51.59,15.47
XTAL1
  Top 0.152: C462.2 41.38,12.12 40.08,12.12 Y401.3 39.4,12.8 39.4,13.95 U401.62
XTAL2
  Top 0.152: C461.2 36.35,10.74 37.64,10.74 Y401.1 37.8,10.67 38.79,11.66 38.79,13.95 U401.61

### Text on the board
tPlace: PWM2 | GPS | PWM5 | CAMERA | P | + | - | GRN | CHARGE | ON | BSL | RESET | Project Yukari 4.0 | 01 Apr 2016
bPlace: St Kwan's Home for | R4 | the Terminally ADD | a division of Kwan Systems | stkwans.blogspot.com
Document: Released under the Creative Commons Attribution Share-Alike 3.0 License | http://creativecommons.org/licenses/by-sa/3.0 | Original design by C. Taylor and N. Seidle, Sparkfun Electronics http://www.sparkfun.com/products/10216 | Heavily modified by C. Jeppesen, St Kwan's Home for the Terminally ADD, stkwans.blogspot.com